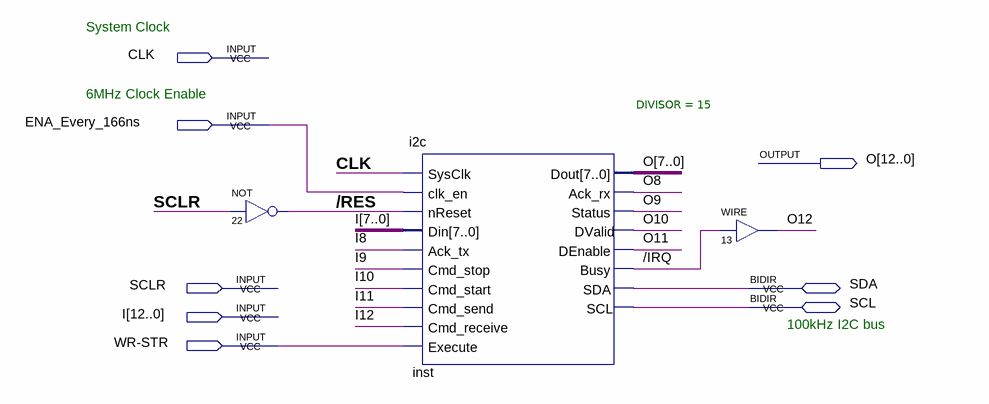
[diagram p0: schematic sheet]
// Quartus schematic i2c_ctrl.bdf as structural Verilog: 3 symbols, 8 pins
module i2c_ctrl (
  input  CLK,
  input  ENA_Every_166ns,
  input  SCLR,
  input  [12:0] I,
  input  \WR-STR ,
  inout  SDA,
  inout  SCL,
  output [12:0] O
);

  wire \/IRQ , \/RES ;

  not u_22 (\/RES , SCLR);
  i2c #(.DIVISOR(15)) inst (
    .SysClk(CLK), .clk_en(ENA_Every_166ns), .nReset(\/RES ), .Din(I[7:0]), .Ack_tx(I[8]), .Cmd_stop(I[9]),
    .Cmd_start(I[10]), .Cmd_send(I[11]), .Cmd_receive(I[12]), .Execute(\WR-STR ), .Dout(O[7:0]),
    .Ack_rx(O[8]), .Status(O[9]), .DValid(O[10]), .DEnable(O[11]), .Busy(\/IRQ ), .SDA(SDA), .SCL(SCL));
  assign O[12] = \/IRQ ;  // WIRE 13

  // Notes on the sheet:
  //   System Clock
  //   6MHz Clock Enable
  //   100kHz I2C bus
endmodule
